# Altium schematic sheet MCU.SchDoc
size A4
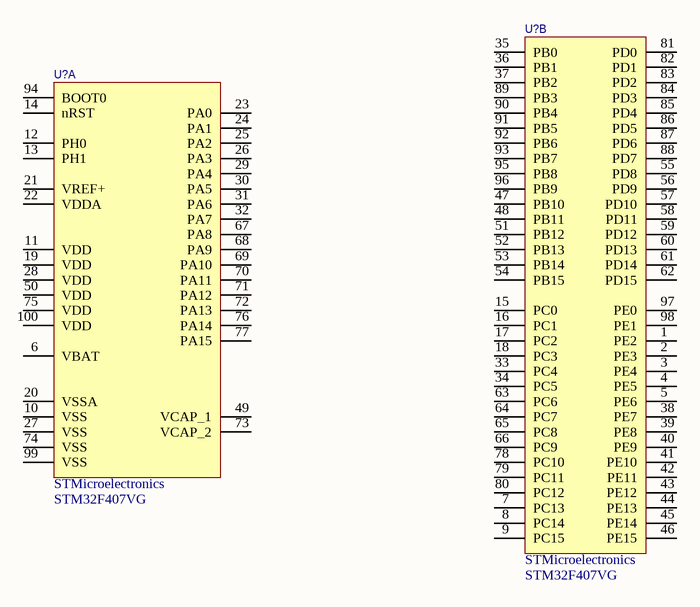
[diagram p0: MCU.SchDoc]

## Parts
(Parts that share a designator on the sheet are numbered #1, #2 ... from top to bottom, then left to right.)
U?#1  Manufacturer: STMicroelectronics  (hidden comment: STM32F407VG)  (part B of 2)
U?#2  Manufacturer: STMicroelectronics  (hidden comment: STM32F407VG)  (part A of 2)

## Nets

Not connected (* = marked no-connect by the designer): U?#1 1(PE2) 2(PE3) 3(PE4) 4(PE5) 5(PE6) 7(PC13) 8(PC14) 9(PC15) 15(PC0) 16(PC1) 17(PC2) 18(PC3) 33(PC4) 34(PC5) 35(PB0) 36(PB1) 37(PB2) 38(PE7) 39(PE8) 40(PE9) 41(PE10) 42(PE11) 43(PE12) 44(PE13) 45(PE14) 46(PE15) 47(PB10) 48(PB11) 51(PB12) 52(PB13) 53(PB14) 54(PB15) 55(PD8) 56(PD9) 57(PD10) 58(PD11) 59(PD12) 60(PD13) 61(PD14) 62(PD15) 63(PC6) 64(PC7) 65(PC8) 66(PC9) 78(PC10) 79(PC11) 80(PC12) 81(PD0) 82(PD1) 83(PD2) 84(PD3) 85(PD4) 86(PD5) 87(PD6) 88(PD7) 89(PB3) 90(PB4) 91(PB5) 92(PB6) 93(PB7) 95(PB8) 96(PB9) 97(PE0) 98(PE1); U?#2 6(VBAT) 10(VSS) 11(VDD) 12(PH0) 13(PH1) 14(nRST) 19(VDD) 20(VSSA) 21(VREF+) 22(VDDA) 23(PA0) 24(PA1) 25(PA2) 26(PA3) 27(VSS) 28(VDD) 29(PA4) 30(PA5) 31(PA6) 32(PA7) 49(VCAP_1) 50(VDD) 67(PA8) 68(PA9) 69(PA10) 70(PA11) 71(PA12) 72(PA13) 73(VCAP_2) 74(VSS) 75(VDD) 76(PA14) 77(PA15) 94(BOOT0) 99(VSS) 100(VDD)

## Library data of the parts
U?#1 U?#2 = STM32F407: Distributor: Digi-Key; Distributor Part Number: *; Manufacturer Part Number: STM32F407VG